# Altium schematic sheet AMP.SchDoc
size A4
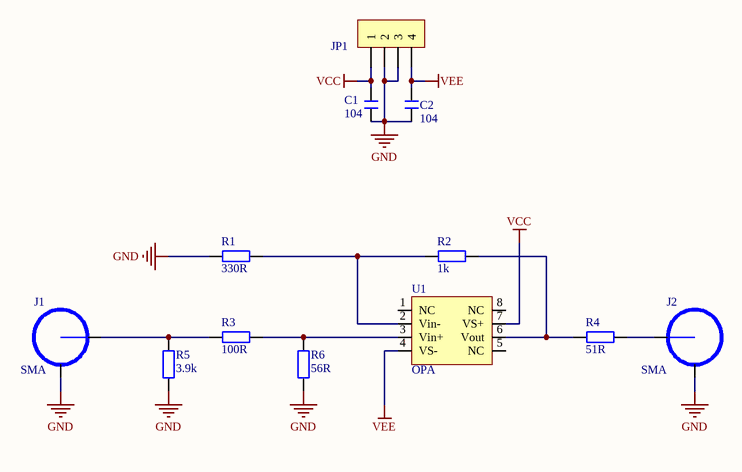
[diagram p0: AMP.SchDoc]

## Parts
C1  104  [C 0805_L]
C2  104  [C 0805_L]
J1  SMA  [HDR2.54-LI-2P]
J2  SMA  [HDR2.54-LI-2P]
JP1  HDR-1X4  [KF2510-LI-4P]  (value not drawn)
R1  330R  [R 0805_L]
R2  1k  [R 0805_L]
R3  100R  [R 0805_L]
R4  51R  [R 0805_L]
R5  3.9k  [R 0805_L]
R6  56R  [R 0805_L]
U1  OPA  [SOP8_M]

## Nets
GND: C1.1 C2.1 J1.2 J2.2 JP1.2 JP1.3 R1.1 R5.1 R6.1
VCC: C1.2 JP1.1 U1.7(VS+)
VEE: C2.2 JP1.4 U1.4(VS-)
NetJ1_1: J1.1 R3.1 R5.2
NetJ2_1: J2.1 R4.2
NetR1_2: R1.2 R2.1 U1.2(Vin-)
NetR2_2: R2.2 R4.1 U1.6(Vout)
NetR3_2: R3.2 R6.2 U1.3(Vin+)

Not connected (* = marked no-connect by the designer): U1 1(NC) 5(NC) 8(NC)

## Library data of the parts
C1 C2 = C: 无极性贴片电容; 版权归属: 源创客; BOM名称: 无极性贴片电容; 学习资源: www.ooocke.com
JP1 = Header 4: 4P接插件; 版权归属: 源创客; BOM名称: 4P接插件; 学习资源: www.ooocke.com
R1-R6 = R: 贴片电阻; 版权归属: 源创客; BOM名称: 贴片电阻; 学习资源: www.ooocke.com
U1 = 单运放